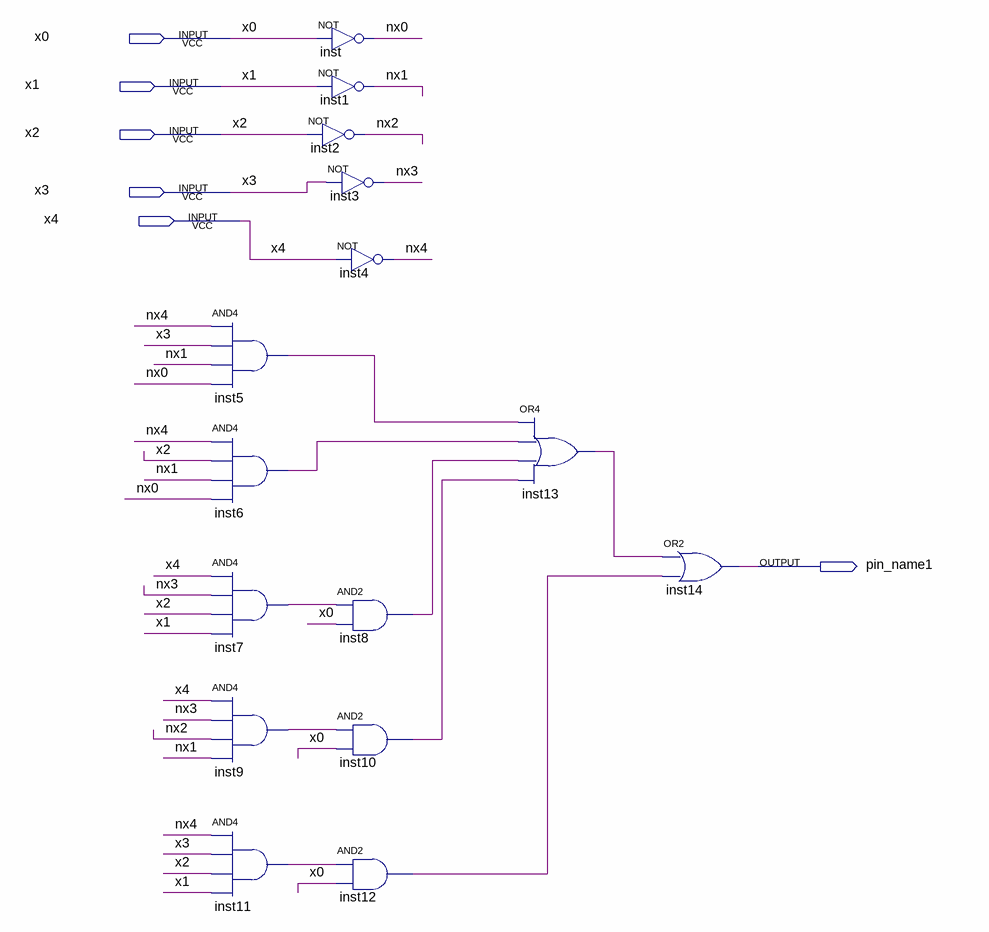
[diagram p0: schematic sheet]
// Quartus schematic mode3_logic.bdf as structural Verilog: 15 symbols, 6 pins
module mode3_logic (
  input  x0,
  input  x1,
  input  x2,
  input  x3,
  input  x4,
  output pin_name1
);

  wire inst5_out, inst6_out, inst7_out, inst8_out, inst9_out, inst10_out, inst11_out, inst12_out, inst13_out,
       nx0, nx1, nx2, nx3, nx4;

  and inst5 (inst5_out, nx4, x3, nx1, nx0);
  and inst6 (inst6_out, nx4, x2, nx1, nx0);
  and inst7 (inst7_out, x4, nx3, x2, x1);
  and inst9 (inst9_out, x4, nx3, nx2, nx1);
  and inst11 (inst11_out, nx4, x3, x2, x1);
  not inst (nx0, x0);
  not inst1 (nx1, x1);
  not inst2 (nx2, x2);
  not inst3 (nx3, x3);
  not inst4 (nx4, x4);
  and inst8 (inst8_out, inst7_out, x0);
  and inst10 (inst10_out, inst9_out, x0);
  and inst12 (inst12_out, inst11_out, x0);
  or inst13 (inst13_out, inst5_out, inst6_out, inst8_out, inst10_out);
  or inst14 (pin_name1, inst13_out, inst12_out);
endmodule
